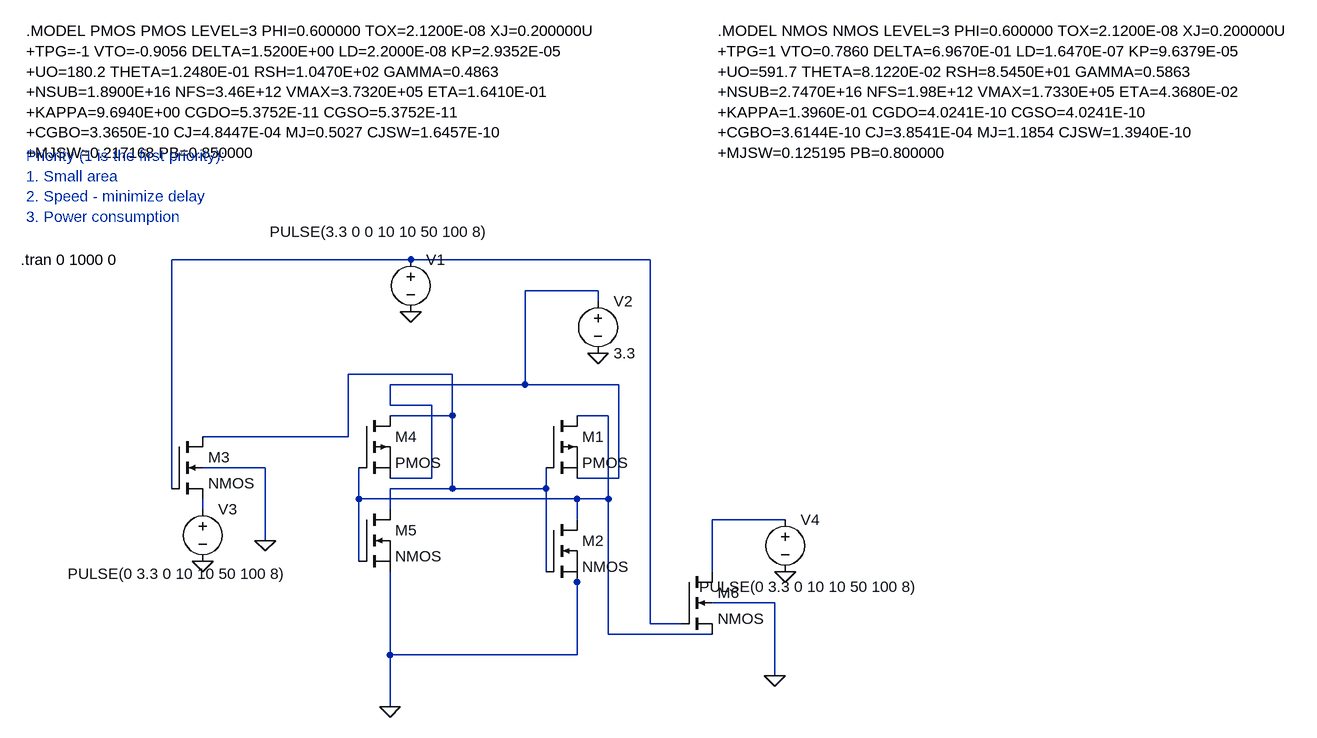
[diagram p0: schematic SRAM_CMOS.asc]
SRAM_CMOS.asc, the LTspice schematic file:
Version 4
SHEET 1 4716 1876
WIRE -608 -320 -976 -320
WIRE -240 -320 -608 -320
WIRE -320 -272 -432 -272
WIRE -320 -256 -320 -272
WIRE -544 -144 -704 -144
WIRE -432 -128 -432 -272
WIRE -432 -128 -640 -128
WIRE -288 -128 -432 -128
WIRE -640 -96 -640 -128
WIRE -576 -96 -640 -96
WIRE -544 -80 -544 -144
WIRE -544 -80 -640 -80
WIRE -304 -80 -352 -80
WIRE -704 -48 -704 -144
WIRE -704 -48 -928 -48
WIRE -832 0 -928 0
WIRE -576 16 -576 -96
WIRE -576 16 -640 16
WIRE -288 16 -288 -128
WIRE -288 16 -352 16
WIRE -976 32 -976 -320
WIRE -544 32 -544 -80
WIRE -544 32 -640 32
WIRE -400 32 -400 0
WIRE -400 32 -544 32
WIRE -688 48 -688 0
WIRE -352 48 -688 48
WIRE -304 48 -304 -80
WIRE -304 48 -352 48
WIRE -928 64 -928 48
WIRE -640 64 -640 32
WIRE -352 80 -352 48
WIRE -32 80 -144 80
WIRE -832 112 -832 0
WIRE -688 144 -688 48
WIRE -400 160 -400 32
WIRE -144 160 -144 80
WIRE -352 176 -352 160
WIRE -48 208 -144 208
WIRE -240 240 -240 -320
WIRE -192 240 -240 240
WIRE -304 256 -304 48
WIRE -144 256 -304 256
WIRE -640 288 -640 160
WIRE -352 288 -352 176
WIRE -352 288 -640 288
WIRE -48 320 -48 208
WIRE -640 368 -640 288
FLAG -832 112 0
FLAG -608 -240 0
FLAG -928 144 0
FLAG -640 368 0
FLAG -48 320 0
FLAG -320 -176 0
FLAG -32 160 0
SYMBOL pmos -400 -80 R0
SYMATTR InstName M1
SYMBOL nmos -400 80 R0
SYMATTR InstName M2
SYMBOL voltage -608 -336 R0
WINDOW 3 -217 -27 Left 2
WINDOW 123 0 0 Left 0
WINDOW 39 0 0 Left 0
SYMATTR Value PULSE(3.3 0 0 10 10 50 100 8)
SYMATTR InstName V1
SYMBOL nmos4 -976 -48 R0
SYMATTR InstName M3
SYMBOL pmos -688 -80 R0
SYMATTR InstName M4
SYMBOL nmos -688 64 R0
SYMATTR InstName M5
SYMBOL nmos4 -192 160 R0
SYMATTR InstName M6
SYMBOL voltage -320 -272 R0
SYMATTR InstName V2
SYMATTR Value 3.3
SYMBOL voltage -928 48 R0
WINDOW 3 -208 115 Left 2
SYMATTR Value PULSE(0 3.3 0 10 10 50 100 8)
SYMATTR InstName V3
SYMBOL voltage -32 64 R0
WINDOW 3 -132 119 Left 2
SYMATTR Value PULSE(0 3.3 0 10 10 50 100 8)
SYMATTR InstName V4
TEXT -1208 -320 Left 2 !.tran 0 1000 0
TEXT -136 -672 Left 2 !.MODEL NMOS NMOS LEVEL=3 PHI=0.600000 TOX=2.1200E-08 XJ=0.200000U \n+TPG=1 VTO=0.7860 DELTA=6.9670E-01 LD=1.6470E-07 KP=9.6379E-05 \n+UO=591.7 THETA=8.1220E-02 RSH=8.5450E+01 GAMMA=0.5863 \n+NSUB=2.7470E+16 NFS=1.98E+12 VMAX=1.7330E+05 ETA=4.3680E-02 \n+KAPPA=1.3960E-01 CGDO=4.0241E-10 CGSO=4.0241E-10\n+CGBO=3.6144E-10 CJ=3.8541E-04 MJ=1.1854 CJSW=1.3940E-10 \n+MJSW=0.125195 PB=0.800000
TEXT -1200 -672 Left 2 !.MODEL PMOS PMOS LEVEL=3 PHI=0.600000 TOX=2.1200E-08 XJ=0.200000U \n+TPG=-1 VTO=-0.9056 DELTA=1.5200E+00 LD=2.2000E-08 KP=2.9352E-05 \n+UO=180.2 THETA=1.2480E-01 RSH=1.0470E+02 GAMMA=0.4863 \n+NSUB=1.8900E+16 NFS=3.46E+12 VMAX=3.7320E+05 ETA=1.6410E-01 \n+KAPPA=9.6940E+00 CGDO=5.3752E-11 CGSO=5.3752E-11\n+CGBO=3.3650E-10 CJ=4.8447E-04 MJ=0.5027 CJSW=1.6457E-10 \n+MJSW=0.217168 PB=0.850000
TEXT -1200 -480 Left 2 ;Priority (1 is the first priority): \n1. Small area\n2. Speed - minimize delay\n3. Power consumption

The netlist it stands for:
* SRAM_CMOS.asc
M1 N004 N003 N002 N002 PMOS
M2 N004 N003 0 0 NMOS
V1 N001 0 PULSE(3.3 0 0 10 10 50 100 8)
M3 N003 N001 N005 0 NMOS
M4 N003 N004 N002 N002 PMOS
M5 N003 N004 0 0 NMOS
M6 N006 N001 N004 0 NMOS
V2 N002 0 3.3
V3 N005 0 PULSE(0 3.3 0 10 10 50 100 8)
V4 N006 0 PULSE(0 3.3 0 10 10 50 100 8)
.model NMOS NMOS
.model PMOS PMOS
.lib standard.mos
.tran 0 1000 0
.MODEL NMOS NMOS LEVEL=3 PHI=0.600000 TOX=2.1200E-08 XJ=0.200000U
+TPG=1 VTO=0.7860 DELTA=6.9670E-01 LD=1.6470E-07 KP=9.6379E-05
+UO=591.7 THETA=8.1220E-02 RSH=8.5450E+01 GAMMA=0.5863
+NSUB=2.7470E+16 NFS=1.98E+12 VMAX=1.7330E+05 ETA=4.3680E-02
+KAPPA=1.3960E-01 CGDO=4.0241E-10 CGSO=4.0241E-10
+CGBO=3.6144E-10 CJ=3.8541E-04 MJ=1.1854 CJSW=1.3940E-10
+MJSW=0.125195 PB=0.800000
.MODEL PMOS PMOS LEVEL=3 PHI=0.600000 TOX=2.1200E-08 XJ=0.200000U
+TPG=-1 VTO=-0.9056 DELTA=1.5200E+00 LD=2.2000E-08 KP=2.9352E-05
+UO=180.2 THETA=1.2480E-01 RSH=1.0470E+02 GAMMA=0.4863
+NSUB=1.8900E+16 NFS=3.46E+12 VMAX=3.7320E+05 ETA=1.6410E-01
+KAPPA=9.6940E+00 CGDO=5.3752E-11 CGSO=5.3752E-11
+CGBO=3.3650E-10 CJ=4.8447E-04 MJ=0.5027 CJSW=1.6457E-10
+MJSW=0.217168 PB=0.850000
* Priority (1 is the first priority):
* 1. Small area
* 2. Speed - minimize delay
* 3. Power consumption
.backanno
.end